# EAGLE design orb (EAGLE 6.4)
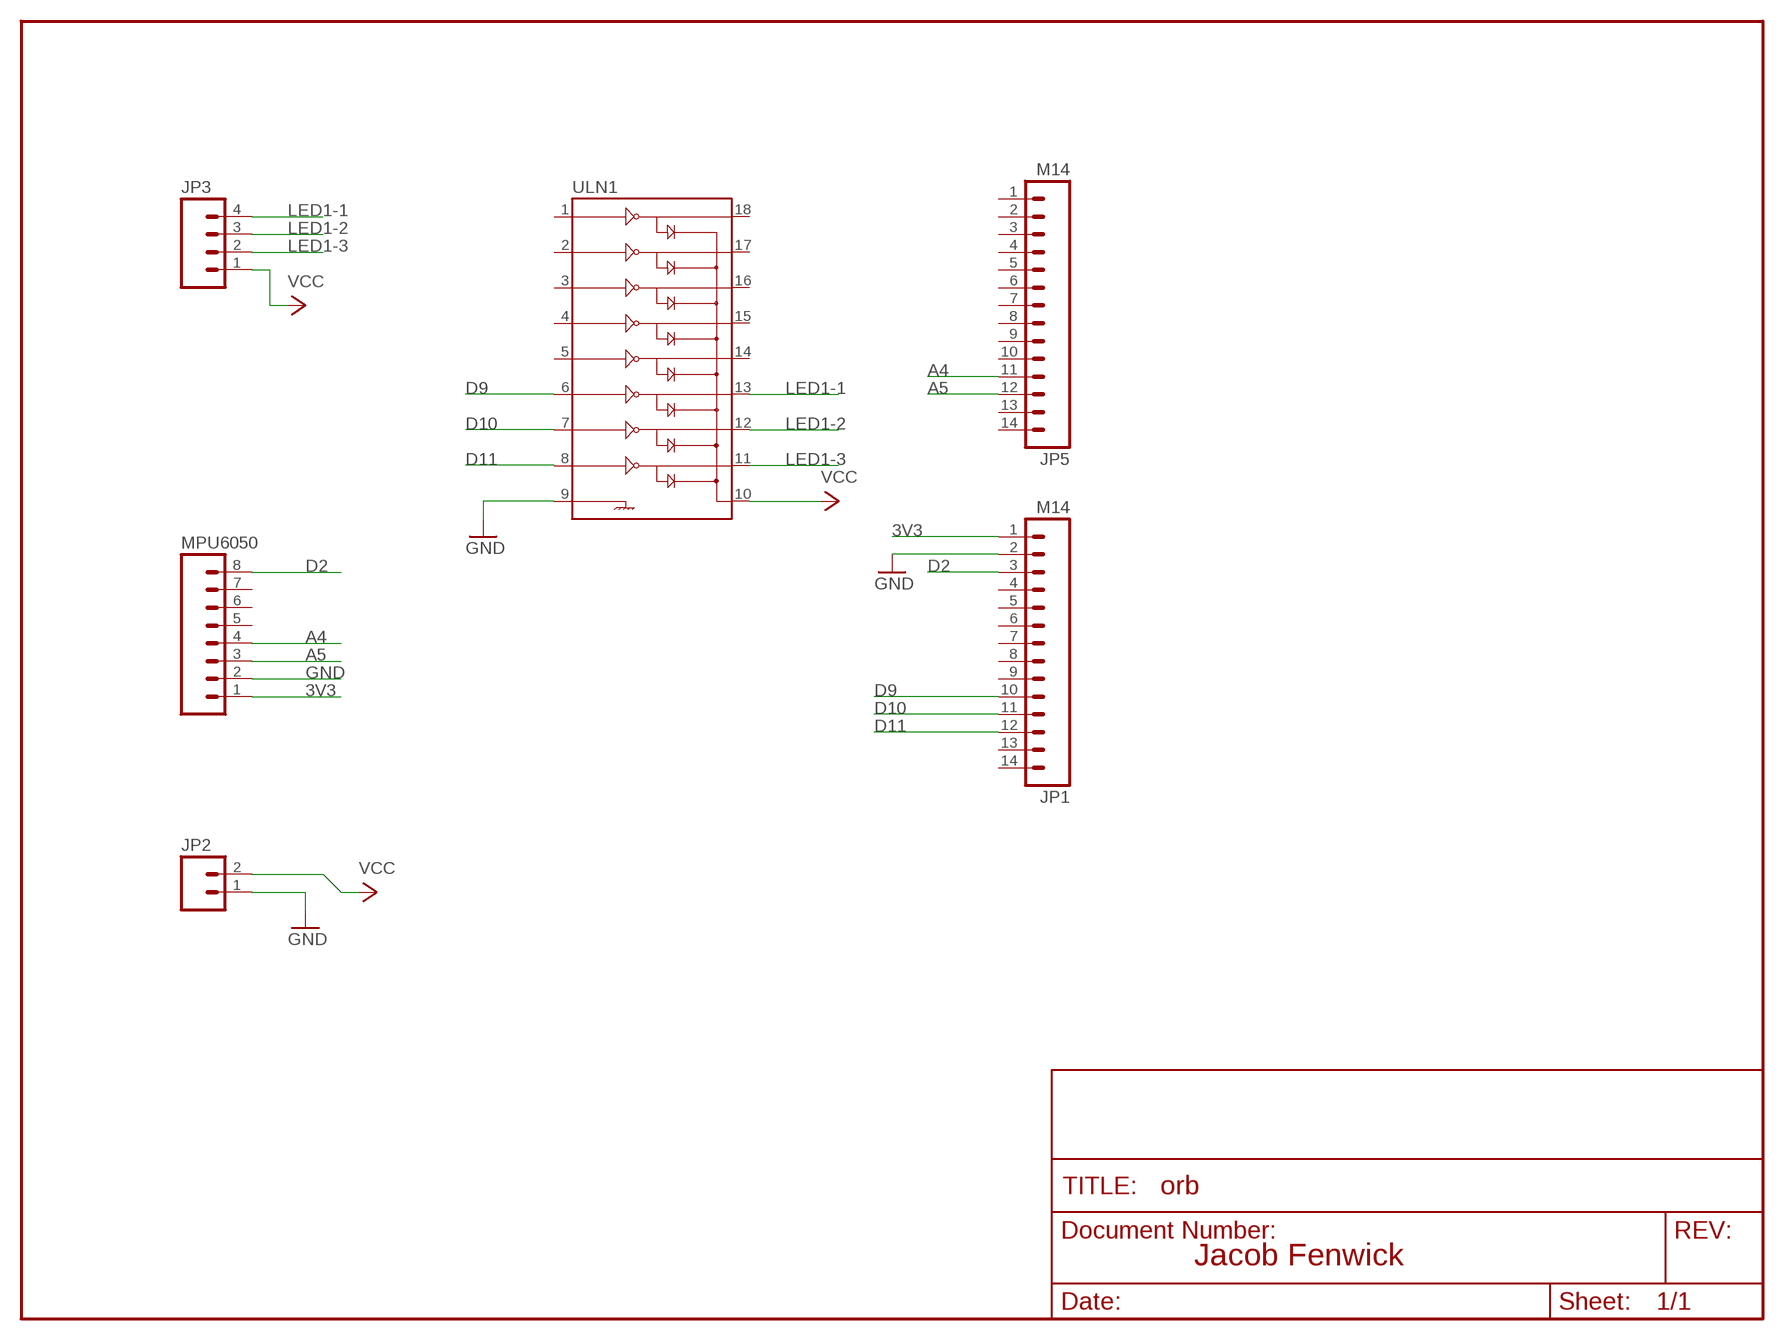
[diagram p0: schematic, sheet 1]

## Parts
JP1  M14  [1X14]
JP2  M02PTH  [1X02]
JP3  M04PTH  [1X04]
JP5  M14  [1X14]
MPU6050  M081X08  [1X08]
ULN1  ULN2803DIP  [DIL18]

## Nets
3V3: JP1.1 MPU6050.1
A4 [LEDPower]: JP5.11 MPU6050.4
A5 [LEDPower]: JP5.12 MPU6050.3
D2: JP1.3 MPU6050.8
D9 [LEDPower]: JP1.10 ULN1.6
D10 [LEDPower]: JP1.11 ULN1.7
D11 [LEDPower]: JP1.12 ULN1.8
GND [LEDPower]: JP1.2 JP2.1 MPU6050.2 ULN1.9
LED1-1 [LEDPower]: JP3.4 ULN1.13
LED1-2 [LEDPower]: JP3.3 ULN1.12
LED1-3 [LEDPower]: JP3.2 ULN1.11
VCC [VCC]: JP2.2 JP3.1 ULN1.10
Unconnected: JP1.4 JP1.5 JP1.6 JP1.7 JP1.8 JP1.9 JP1.13 JP1.14 JP5.1 JP5.2 JP5.3 JP5.4 JP5.5 JP5.6 JP5.7 JP5.8 JP5.9 JP5.10 JP5.13 JP5.14 MPU6050.5 MPU6050.6 MPU6050.7 ULN1.1 ULN1.2 ULN1.3 ULN1.4 ULN1.5 ULN1.14 ULN1.15 ULN1.16 ULN1.17 ULN1.18

## Notes on the sheet
- Jacob Fenwick

## Library data of the parts
JP1 JP5 = SparkFun:M14: Header 14 Standard 14-pin 0.1" header. Use with straight break away headers (SKU : PRT-00116), right angle break away headers (PRT-00553), swiss pins (PRT-00743), machine pins (PRT-00117), and female headers (PRT-00115).
JP2 = SparkFun:M02: Header 2 Standard 2-pin 0.1" header. Use with straight break away headers (SKU : PRT-00116), right angle break away headers (PRT-00553), swiss pins (PRT-00743), machine pins (PRT-00117), and female headers (PRT-00115). Molex polarized connector foot print use with SKU : PRT-08233 with associated crimp pins and housings.
JP3 = SparkFun-Connectors:M04: Header 4 Standard 4-pin 0.1" header. Use with straight break away headers (SKU : PRT-00116), right angle break away headers (PRT-00553), swiss pins (PRT-00743), machine pins (PRT-00117), and female headers (PRT-00115). Molex polarized connector foot print use with SKU : PRT-08231 with associated crimp pins and housings. 1MM SMD Version SKU: PRT-10208
MPU6050 = SparkFun-Connectors:M08: Header 8 Standard 8-pin 0.1" header. Use with straight break away headers (SKU : PRT-00116), right angle break away headers (PRT-00553), swiss pins (PRT-00743), machine pins (PRT-00117), and female headers (PRT-00115).
ULN1 = SparkFun-PowerIC:ULN2803: Darlington Driver ULN2803 Darlington array. 500mA max per channel, 8-channel package. Spark Fun Electronics SKU : COM-00312

## Net classes
0 Default: width 0.305 mm
1 VCC: width 0.635 mm
2 LEDPower: width 0.635 mm
3 ButtonSignal: width 0.203 mm

## Board
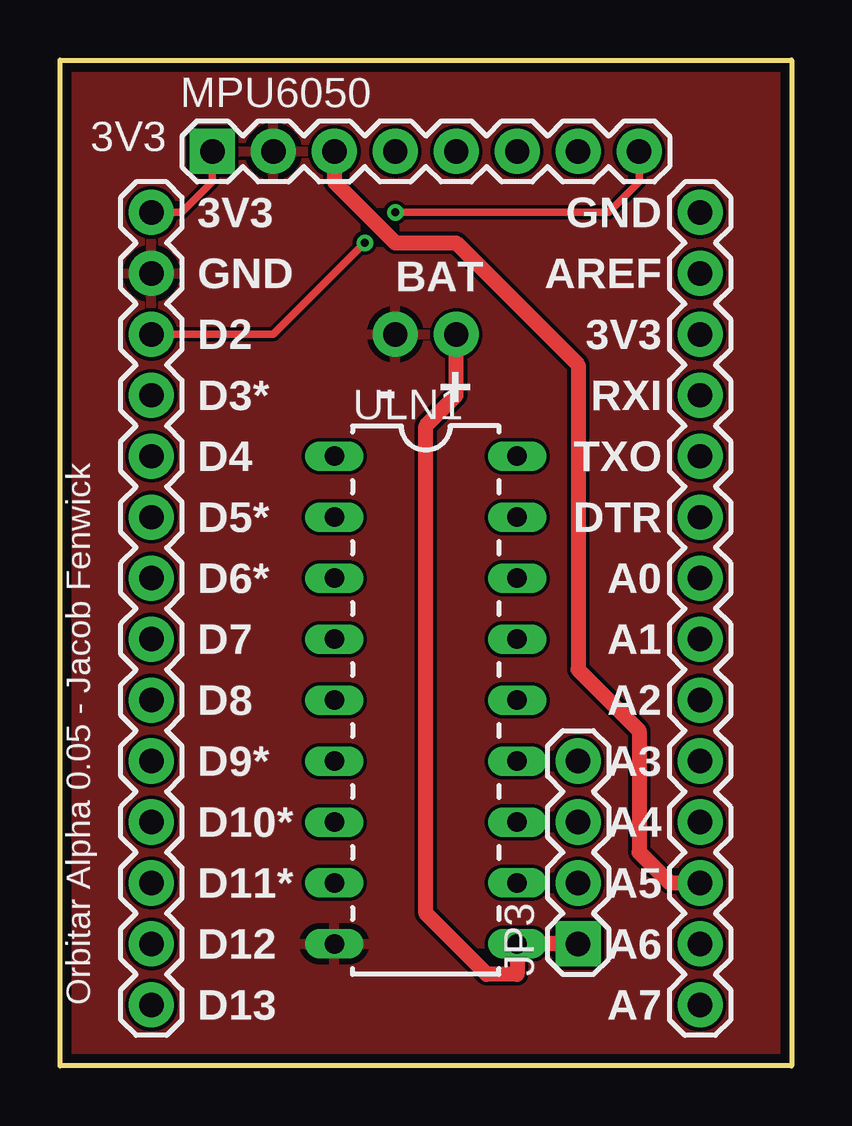
[diagram p1: board, top side]
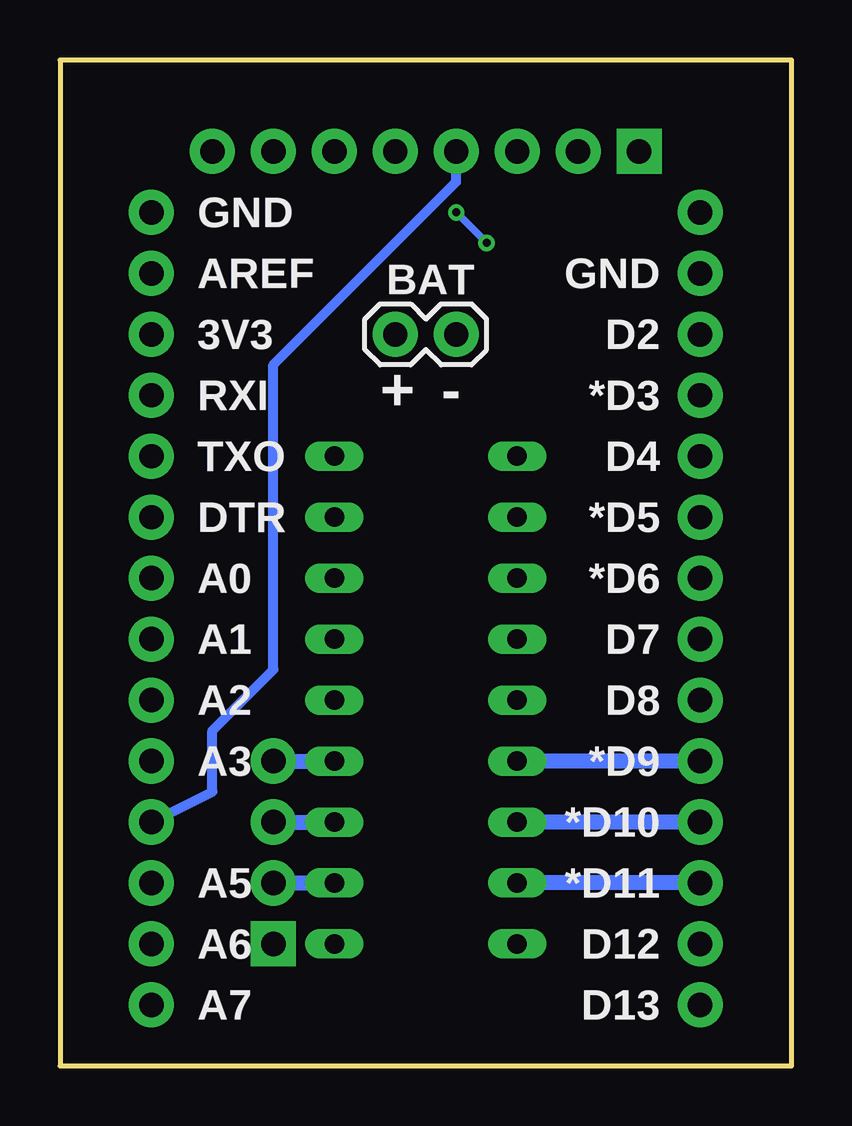
[diagram p2: board, bottom side, seen from below]

Size 30.48 x 41.91 mm. Coordinates in mm from the lower left corner, seen from the top.
Outline: 30.48,41.91 30.48,0 0,0 0,41.91 30.48,41.91
Copper layers (1*16): Top 0.0356mm / dielectric 1.5011mm / Bottom 0.0356mm
Design rules "LaenPCBOrder": minimum track width 6mil, minimum drill 13mil, track to track 6mil, track to pad 6mil, pad to pad 6mil, via to via 6mil, smd to smd 6mil, copper to edge 15mil, drill to drill 6mil, minimum pad ring 7mil, minimum via ring 7mil, stop-mask expansion 4mil, vias tented up to drill 0mil, thermal gap 10mil

### Footprints (pad centres in the part's own frame; a part is rotated, then mirrored left to right if it is on the bottom)
1X14 = drill 1.016 pad 1.88: 1 0,0; 2 2.54,0; 3 5.08,0; 4 7.62,0; 5 10.16,0; 6 12.7,0; 7 15.24,0; 8 17.78,0; 9 20.32,0; 10 22.86,0; 11 25.4,0; 12 27.94,0; 13 30.48,0; 14 33.02,0
1X02 = drill 1.016 pad 1.88: 1 0,0; 2 2.54,0
1X04 = drill 1.016 pad 1.88 square: 1 0,0 | drill 1.016 pad 1.88: 2 2.54,0; 3 5.08,0; 4 7.62,0
1X08 = drill 1.016 pad 1.88 square: 1 0,0 | drill 1.016 pad 1.88: 2 2.54,0; 3 5.08,0; 4 7.62,0; 5 10.16,0; 6 12.7,0; 7 15.24,0; 8 17.78,0
DIL18 = drill 0.813 long: 1 -10.16,-3.81; 2 -7.62,-3.81; 3 -5.08,-3.81; 4 -2.54,-3.81; 5 0,-3.81; 6 2.54,-3.81; 7 5.08,-3.81; 8 7.62,-3.81; 9 10.16,-3.81; 10 10.16,3.81; 11 7.62,3.81; 12 5.08,3.81; 13 2.54,3.81; 14 0,3.81; 15 -2.54,3.81; 16 -5.08,3.81; 17 -7.62,3.81; 18 -10.16,3.81

### Placement (x,y rotation side)
JP1  3.81,35.56 270 top
JP2  13.97,30.48 180 bottom
JP3  21.59,5.08 90 top
JP5  26.67,35.56 270 top
MPU6050  6.35,38.1 0 top
ULN1  15.24,15.24 270 top

### Tracks (layer width: path | path; a pad name or v marks a point on that pad's centre or on a via)
3V3
  Top 0.305: JP1.1 5.08,35.56 6.35,36.83 MPU6050.1
A4
  Bottom 0.406: JP5.11 24.13,11.43 24.13,13.97 21.59,16.51 21.59,29.21 13.97,36.83 MPU6050.4
A5
  Top 0.635: JP5.12 25.4,7.62 24.13,8.89 24.13,13.97 21.59,16.51 21.59,29.21 16.51,34.29 13.97,34.29 11.43,36.83 MPU6050.3
D2  (via drill 0.33)
  Top 0.305: JP1.3 8.89,30.48 v12.7,34.29 | v13.97,35.56 22.86,35.56 24.13,36.83 MPU6050.8
  Bottom 0.305: v13.97,35.56 v12.7,34.29
D9
  Bottom 0.635: JP1.10 ULN1.6
D10
  Bottom 0.635: JP1.11 ULN1.7
D11
  Bottom 0.635: JP1.12 ULN1.8
GND
  pour Top: -1.27,43.18 31.75,43.18 31.75,-1.27 -1.27,-1.27
LED1-1
  Bottom 0.635: JP3.4 ULN1.13
LED1-2
  Bottom 0.635: JP3.3 ULN1.12
LED1-3
  Bottom 0.635: JP3.2 ULN1.11
VCC
  Top 0.635: JP3.1 ULN1.10 19.05,3.81 17.78,3.81 15.24,6.35 15.24,26.67 16.51,27.94 JP2.2

### Text on the board
tPlace: 3V3 | GND | 3V3 | AREF | GND | BAT | 3V3 | D2 | RXI | D3* | - | + | TXO | D4 | DTR | D5* | A0 | D6* | A1 | D7 | A2 | D8 | A3 | D9* | A4 | D10* | A5 | D11* | A6 | D12 | A7 | Orbitar Alpha 0.05 - Jacob Fenwick | D13 | Orbitar Satellite PCB Breakout Alpha 0.05 6/7/2013 | Jacob Fenwick - www.theorbitar.com
bPlace: GND | GND | BAT | AREF | D2 | 3V3 | *D3 | - | + | RXI | D4 | TXO | *D5 | DTR | *D6 | A0 | D7 | A1 | D8 | A2 | *D9 | A3 | *D10 | *D11 | A5 | D12 | A6 | D13 | A7